# EAGLE design LCD (EAGLE 5.06)
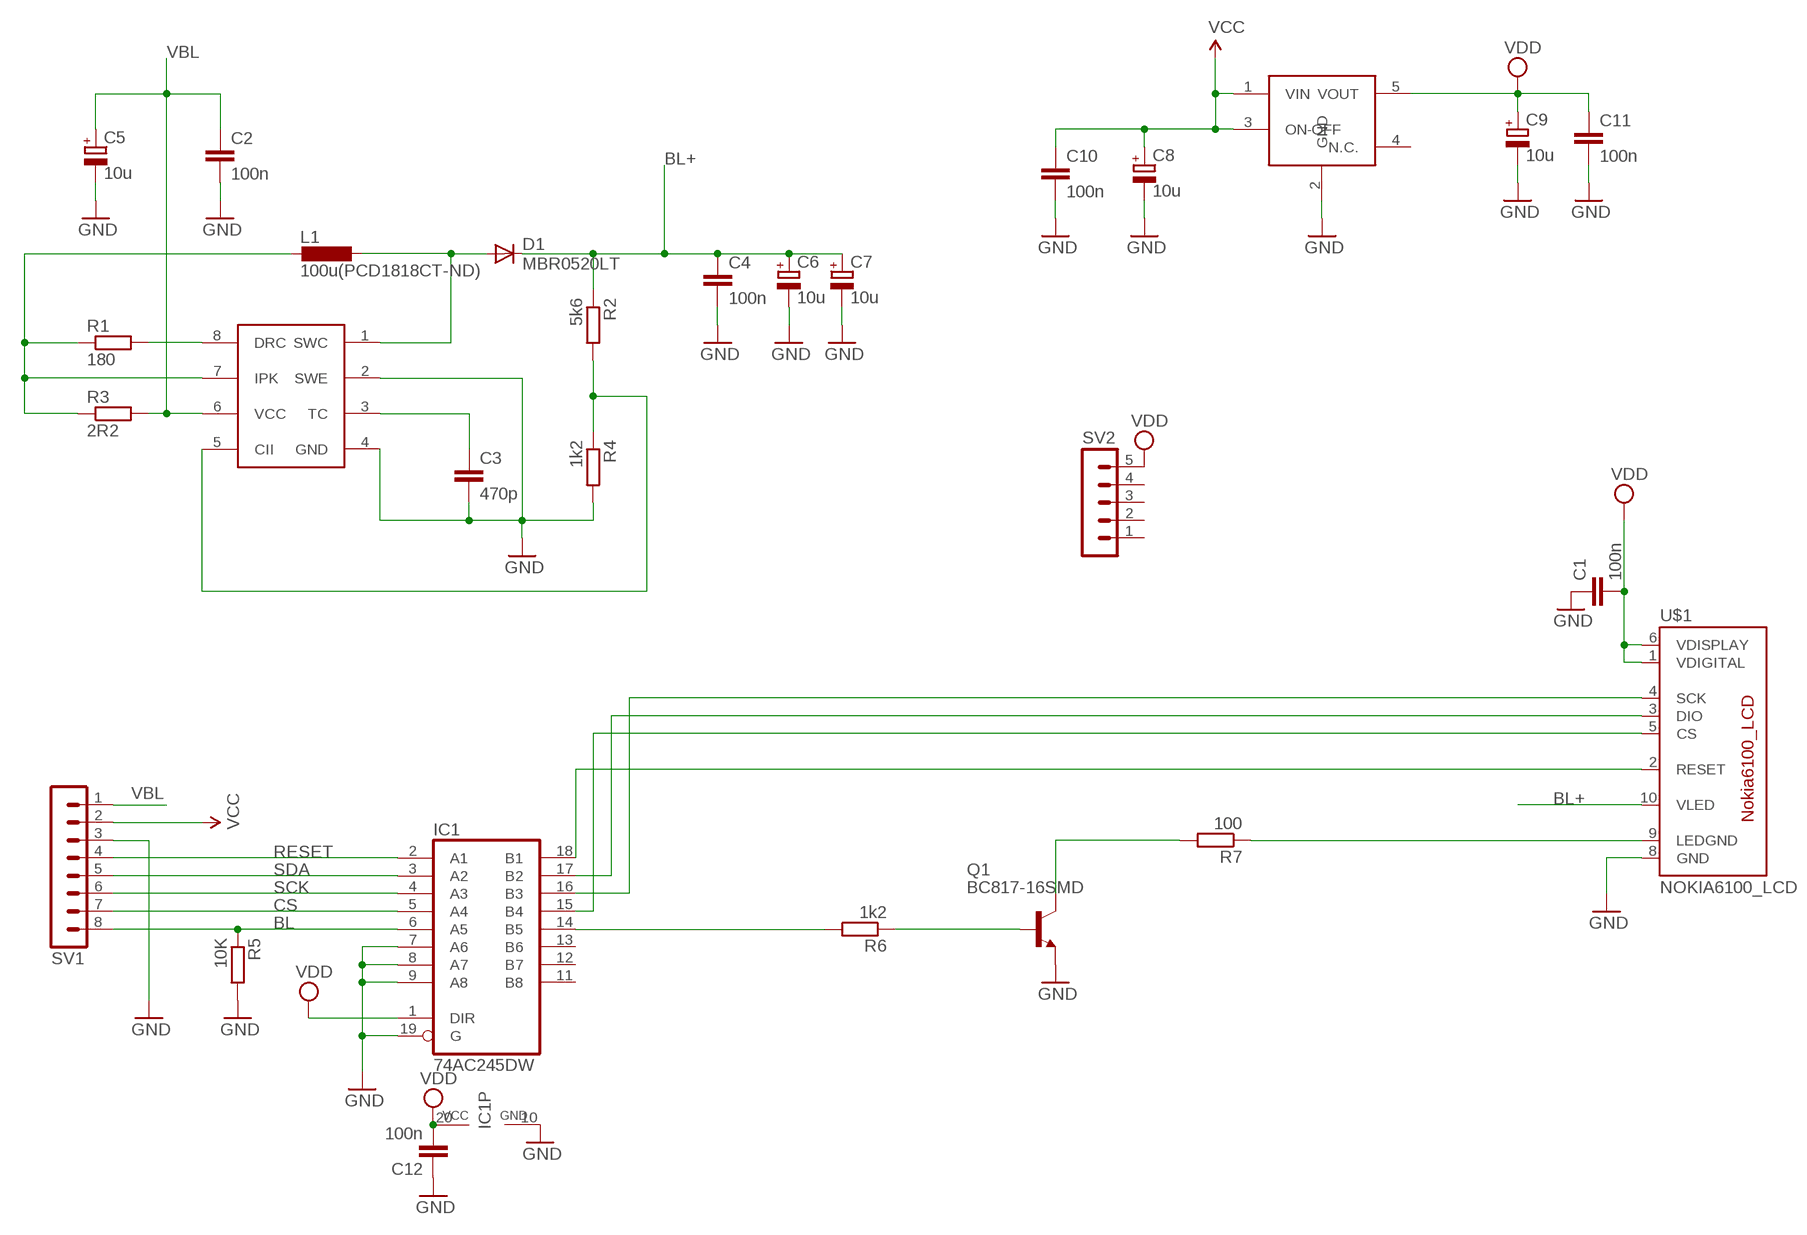
[diagram p0: schematic, sheet 1]

## Parts
C1  100n  C-EUC0805  [C0805]
C2  100n  C-EUC0805  [C0805]
C3  470p  C-EUC0805  [C0805]
C4  100n  C-EUC0805  [C0805]
C5  10u  CPOL-EUA/3216-18W  [A/3216-18W]
C6  10u  CPOL-EUA/3216-18W  [A/3216-18W]
C7  10u  CPOL-EUA/3216-18W  [A/3216-18W]
C8  10u  CPOL-EUA/3216-18W  [A/3216-18W]
C9  10u  CPOL-EUA/3216-18W  [A/3216-18W]
C10  100n  C-EUC0805  [C0805]
C11  100n  C-EUC0805  [C0805]
C12  100n  C-EUC0805  [C0805]
D1  MBR0520LT  [SOD123]
IC1  74AC245DW  [SO20W]
L1  100u(PCD1818CT-ND)  L-EUL3225M  [L3225M]
Q1  BC817-16SMD  [SOT23-BEC]
R1  180  R-EU_R0805  [R0805]
R2  5k6  R-EU_R0805  [R0805]
R3  2R2  R-EU_R0805  [R0805]
R4  1k2  R-EU_R0805  [R0805]
R5  10K  R-EU_R0805  [R0805]
R6  1k2  R-EU_R0805  [R0805]
R7  100  R-EU_R0805  [R0805]
SV1  MA08-1  [MA08-1]
SV2  MA05-1  [MA05-1]
U1  MC34063  [SO08]
U2  LP2981  [SOT23-5]
U$1  NOKIA6100_LCD  [NOKIA6100_LCD]

## Nets
BL: IC1.6(A5) R5.1 SV1.8
BL+: C4.1 C6.+ C7.+ D1.C R2.1 U$1.10(VLED)
CS: IC1.5(A4) SV1.7
GND: C1.1 C2.2 C3.2 C4.2 C5.- C6.- C7.- C8.- C9.- C10.2 C11.2 C12.1 IC1.7(A6) IC1.8(A7) IC1.9(A8) IC1.10(GND) IC1.19(G) Q1.E R4.2 R5.2 SV1.3 U1.2(SWE) U1.4(GND) U2.2(GND) U$1.8(GND)
N$1: C3.1 U1.3(TC)
N$2: Q1.B R6.1
N$3: R7.1 U$1.9(LEDGND)
N$4: IC1.18(B1) U$1.2(RESET)
N$5: IC1.15(B4) U$1.5(CS)
N$6: IC1.17(B2) U$1.3(DIO)
N$7: IC1.16(B3) U$1.4(SCK)
N$8: IC1.14(B5) R6.2
N$9: R1.2 U1.8(DRC)
N$10: D1.A L1.1 U1.1(SWC)
N$11: L1.2 R1.1 R3.1 U1.7(IPK)
N$12: R2.2 R4.1 U1.5(CII)
N$13: Q1.C R7.2
RESET: IC1.2(A1) SV1.4
SCK: IC1.4(A3) SV1.6
SDA: IC1.3(A2) SV1.5
VBL: C2.1 C5.+ R3.2 SV1.1 U1.6(VCC)
VCC: C8.+ C10.1 SV1.2 U2.1(VIN) U2.3(ON-OFF)
VDD: C1.2 C9.+ C11.1 C12.2 IC1.1(DIR) IC1.20(VCC) SV2.5 U2.5(VOUT) U$1.1(VDIGITAL) U$1.6(VDISPLAY)
Unconnected: IC1.11(B8) IC1.12(B7) IC1.13(B6) SV2.1 SV2.2 SV2.3 SV2.4 U2.4(N.C.)

## Library data of the parts
C1-C4 C10-C12 = rcl:C-EU: CAPACITOR, European symbol
C5-C9 = rcl:CPOL-EU: POLARIZED CAPACITOR, European symbol
D1 = diode:MBR0520LT: SCHOTTKY BARRIER RECTIFIER Source: http://onsemi.com .. MBR0520LT1-D.pdf
IC1 = 74xx-eu:74*245: Octal BUS TRANSCEIVER, 3-state
L1 = rcl:L-EU: INDUCTOR, European symbol
Q1 = transistor-npn:BC817*: NPN Transistor
R1-R7 = rcl:R-EU_: RESISTOR, European symbol
SV1 = con-lstb:MA08-1: PIN HEADER
SV2 = con-lstb:MA05-1: PIN HEADER
U1 = MC34063:MC34063
U2 = LP2981:LP2981
U$1 = SparkFun:NOKIA6100_LCD: Nokia 6100 Color LCD Schematic element and footprint production proven but could use some touching up. Spark Fun Electronics SKU : LCD-00569. Mating SMD connector : LCD-00570

## Net classes
0 default: width 0.203 mm, drill 0.305 mm, clearance 0.152 mm
1 power: width 0.254 mm, drill 0.508 mm, clearance 0.152 mm
2 gnd: width 0.254 mm, drill 0.508 mm, clearance 0.152 mm

## Board
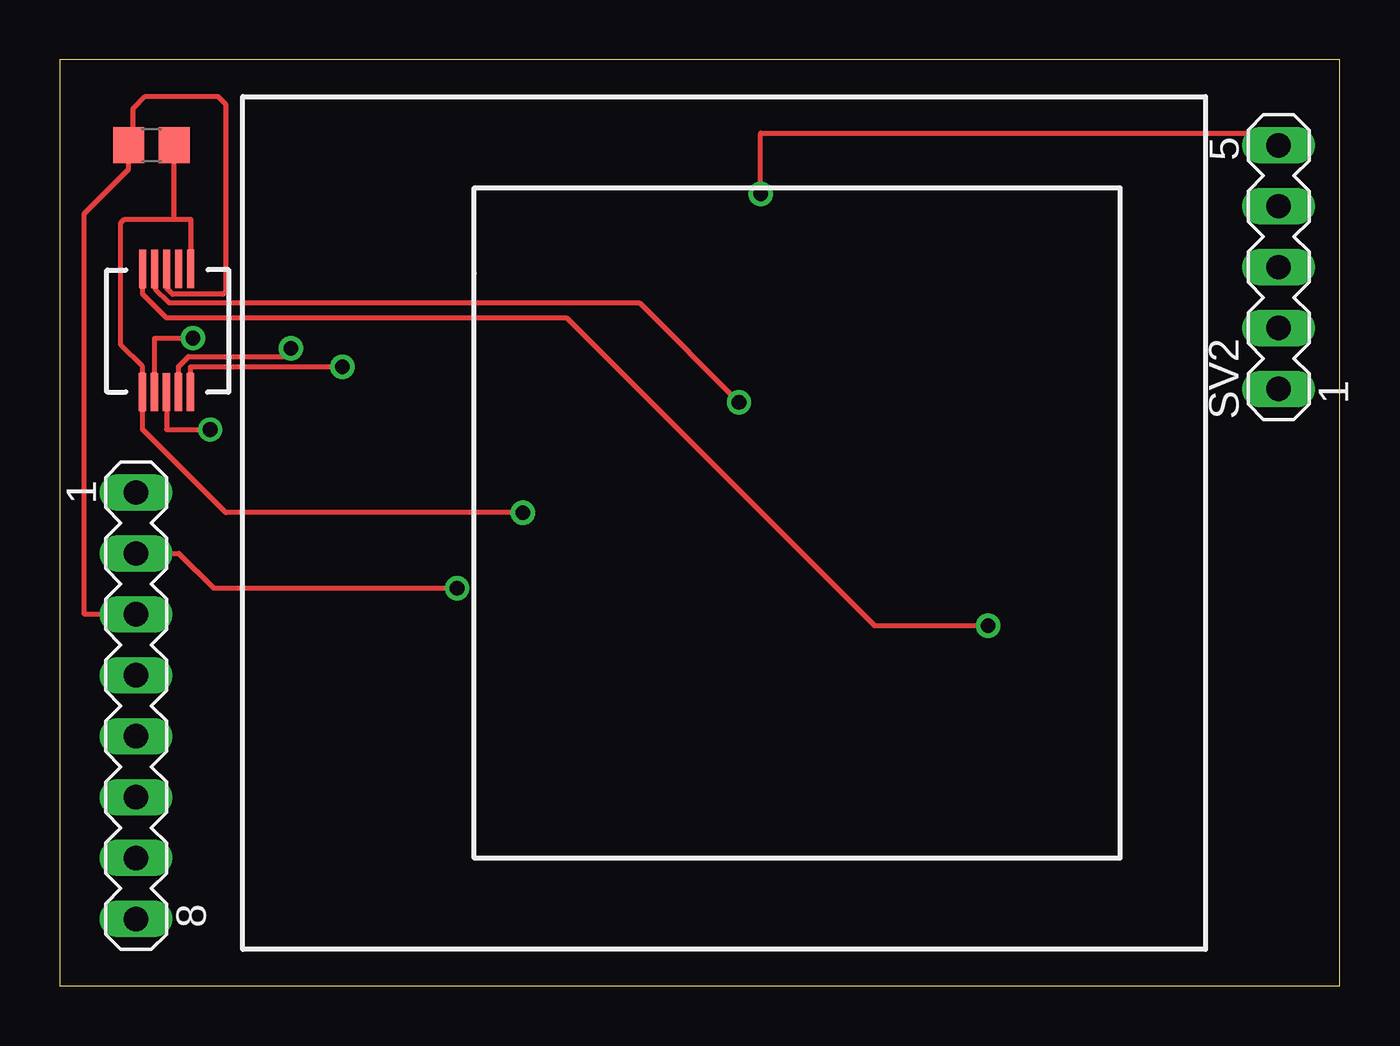
[diagram p1: board, top side]
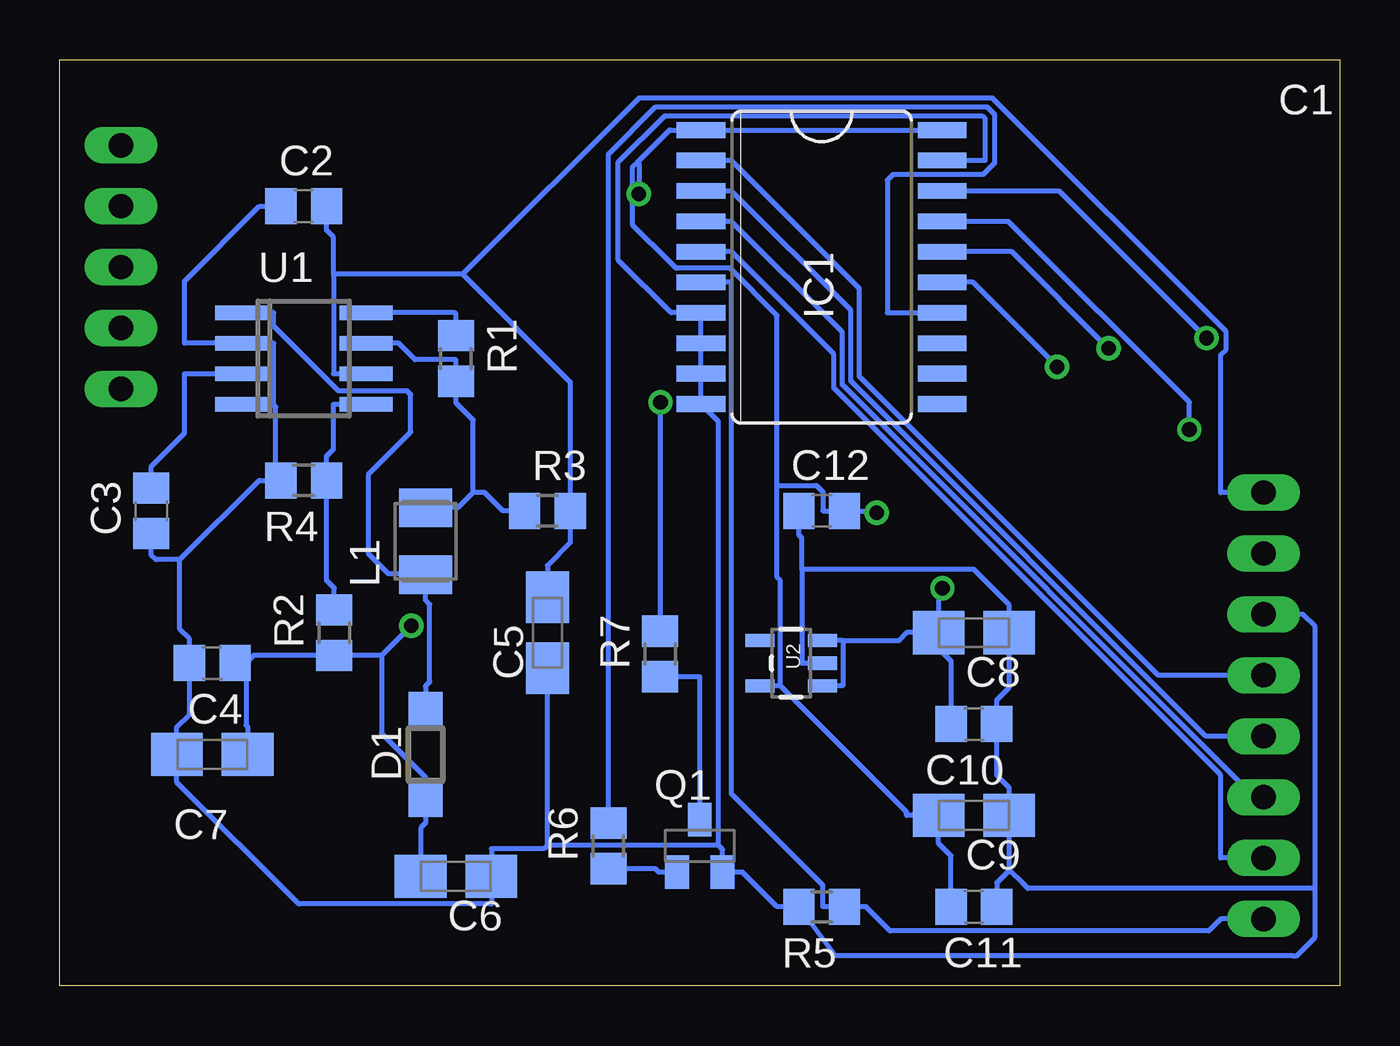
[diagram p2: board, bottom side, seen from below]

Size 53.34 x 38.61 mm. Coordinates in mm from the lower left corner, seen from the top.
Outline: 0,0 53.34,0 53.34,38.61 0,38.61 0,0
Copper layers (1*16): Top 0.035mm / dielectric 1.5mm / Bottom 0.035mm
Design rules "default *": minimum track width 6mil, minimum drill 24mil, track to track 6mil, track to pad 6mil, pad to pad 6mil, via to via 6mil, smd to smd 6mil, copper to edge 6mil, drill to drill 6mil, minimum pad ring 10mil, minimum via ring 8mil, stop-mask expansion 4mil, vias tented up to drill 0mil, thermal gap 10mil

### Footprints (pad centres in the part's own frame; a part is rotated, then mirrored left to right if it is on the bottom)
C0805 = smd 1.3 x 1.5: 1 -0.95,0; 2 0.95,0
A/3216-18W = smd 2.15 x 1.8: + 1.475,0; - -1.475,0
SOD123 = smd 1.4 x 1.4: A 1.9,0; C -1.9,0
SO20W = smd 0.66 x 2.032: 1 -5.715,-5.029; 2 -4.445,-5.029; 3 -3.175,-5.029; 4 -1.905,-5.029; 5 -0.635,-5.029; 6 0.635,-5.029; 7 1.905,-5.029; 8 3.175,-5.029; 9 4.445,-5.029; 10 5.715,-5.029; 11 5.715,5.029; 12 4.445,5.029; 13 3.175,5.029; 14 1.905,5.029; 15 0.635,5.029; 16 -0.635,5.029; 17 -1.905,5.029; 18 -3.175,5.029; 19 -4.445,5.029; 20 -5.715,5.029
L3225M = smd 1.6 x 2.2: 1 -1.4,0; 2 1.4,0
SOT23-BEC = smd 1 x 1.4: B -0.95,-1.1; C 0,1.1; E 0.95,-1.1
R0805 = smd 1.3 x 1.5: 1 -0.95,0; 2 0.95,0
MA08-1 = drill 1.016 long: 1 -8.89,0; 2 -6.35,0; 3 -3.81,0; 4 -1.27,0; 5 1.27,0; 6 3.81,0; 7 6.35,0; 8 8.89,0
MA05-1 = drill 1.016 long: 1 -5.08,0; 2 -2.54,0; 3 0,0; 4 2.54,0; 5 5.08,0
SO08 = smd 0.6 x 2.2: 1 -1.905,-2.6; 2 -0.635,-2.6; 3 0.635,-2.6; 4 1.905,-2.6; 5 1.905,2.6; 6 0.635,2.6; 7 -0.635,2.6; 8 -1.905,2.6
SOT23-5 = smd 0.55 x 1.2: 1 -0.95,-1.3; 2 0,-1.3; 3 0.95,-1.3; 4 0.95,1.3; 5 -0.95,1.3
NOKIA6100_LCD = smd 1.6 x 0.3: 1 24.255,44.311; 2 24.255,43.811; 3 24.255,43.311; 4 24.255,42.811; 5 24.255,42.311; 6 29.389,42.303; 7 29.389,42.803; 8 29.389,43.303; 9 29.389,43.803; 10 29.389,44.303

### Placement (x,y rotation side)
C1  3.81,35.05 0 top
C2  43.18,32.51 180 bottom
C3  49.53,19.81 270 bottom
C4  46.99,13.46 180 bottom
C5  33.02,14.73 90 bottom
C6  36.83,4.57 180 bottom
C7  46.99,9.65 0 bottom
C8  15.24,14.73 180 bottom
C9  15.24,7.11 180 bottom
C10  15.24,10.92 0 bottom
C11  15.24,3.3 0 bottom
C12  21.59,19.81 0 bottom
D1  38.1,9.65 90 bottom
IC1  21.59,29.97 270 bottom
L1  38.1,18.54 90 bottom
Q1  26.67,5.84 0 bottom
R1  36.83,26.16 90 bottom
R2  41.91,14.73 90 bottom
R3  33.02,19.81 0 bottom
R4  43.18,21.08 180 bottom
R5  21.59,3.3 180 bottom
R6  30.48,5.84 90 bottom
R7  28.32,13.84 270 bottom
SV1  3.17,11.68 270 top
SV2  50.8,29.97 90 top
U1  43.18,26.16 270 bottom
U2  22.86,13.46 90 bottom
U$1  47.75,0.51 90 top

### Tracks (layer width: path | path; a pad name or v marks a point on that pad's centre or on a via)
BL
  Bottom 0.203: SV1.8 4.95,2.79 5.45,2.3 18.73,2.3 19.74,3.3 R5.1 21.54,3.3 21.54,4.21 25.35,8.01 25.35,29.34 IC1.6
BL+  (via drill 0.61 pad 1.02)
  Top 0.203: U$1.10 3.45,28.84 4.43,27.86 21.11,27.86 33.95,15.03 v38.69,15.03
  Bottom 0.203: v38.69,15.03 39.94,13.78 | 39.94,13.78 R2.1 45.27,13.78 45.59,13.46 | 39.94,13.78 39.94,10.54 38.1,8.71 D1.C 38.1,6.8 38.3,6.59 C6.+ | C7.+ 45.52,10.81 45.59,10.88 45.59,13.46 | 45.59,13.46 C4.1
CS
  Bottom 0.203: IC1.5 25.35,30.61 21.08,26.34 21.08,24.92 4.95,8.79 4.95,5.33 SV1.7
GND
  Top 0.203: U$1.8 4.45,29.09 4.69,28.84 6.8,28.84 6.9,28.95 6.9,36.77 6.58,37.09 3.56,37.09 3.05,36.58 3.05,35.24 C1.1 2.86,34.05 1.02,32.2 1.02,15.49 SV1.3
  Bottom 0.203: 22.41,17.37 22.41,18.68 22.54,18.81 C12.1 | 22.41,17.37 22.41,13.46 U2.2 | 22.41,17.37 15.25,17.37 13.77,15.89 C8.- 13.77,12.45 14.29,11.93 C10.2 14.29,8.79 13.77,8.27 C9.- 13.77,4.83 | 13.77,4.83 13.18,4.25 13,4.06 1.02,4.06 | C11.2 14.29,4.31 13.77,4.83 | 25.9,5.87 25.9,23.53 IC1.10 IC1.9 IC1.8 IC1.7 27.86,28.07 30.07,30.27 30.07,34.34 28.12,36.28 14.9,36.28 14.78,36.17 14.78,34.42 IC1.19 | 33.02,5.87 33.17,5.73 35.35,5.73 C6.- 35.35,3.42 43.38,3.42 48.47,8.5 C7.- 48.47,10.81 47.94,11.33 C4.2 47.94,14.47 48.34,14.87 48.34,17.77 | 25.9,5.87 33.02,5.87 | 25.9,5.87 25.72,5.7 Q1.E 24.88,4.74 23.44,3.3 R5.2 21.01,1.27 1.96,1.27 1.78,1.27 1.02,2.03 1.02,4.06 | 33.02,5.87 C5.- | 44.34,21.08 45.03,21.08 48.34,17.77 | 44.34,21.08 R4.2 | 44.45,24.26 44.34,24.14 44.34,21.08 | 44.45,24.26 44.43,24.26 44.43,26.8 U1.2 48.15,26.8 48.15,29.4 45.03,32.51 C2.2 | 44.45,24.26 U1.4 | 48.34,17.77 49.34,17.77 49.53,17.96 C3.2 | 1.02,4.06 1.02,14.99 1.52,15.49 SV1.3
N$1
  Bottom 0.203: C3.1 49.53,21.67 48.15,23.05 48.15,25.53 U1.3
N$2
  Bottom 0.203: Q1.B 28.37,4.74 28.52,4.89 R6.1
N$3  (via drill 0.61 pad 1.02)
  Top 0.203: U$1.9 3.95,29.09 4.55,28.49 24.15,28.49 v28.31,24.33
  Bottom 0.203: v28.31,24.33 28.32,24.33 R7.1
N$4  (via drill 0.61 pad 1.02)
  Top 0.203: v5.55,27.01 3.94,27.01 3.94,25.82 U$1.2
  Bottom 0.203: IC1.18 11.68,33.15 v5.55,27.01
N$5  (via drill 0.61 pad 1.02)
  Top 0.203: v11.77,25.82 5.44,25.82 U$1.5
  Bottom 0.203: v11.77,25.82 15.29,29.34 IC1.15
N$6  (via drill 0.61 pad 1.02)
  Top 0.203: v6.26,23.2 4.44,23.2 U$1.3
  Bottom 0.203: 15.29,31.88 | 15.29,31.88 13.8,31.88 6.26,24.34 v6.26,23.2 | 15.29,31.88 IC1.17
N$7  (via drill 0.61 pad 1.02)
  Top 0.203: U$1.4 4.94,25.83 5.36,26.25 9.3,26.25 v9.63,26.58
  Bottom 0.203: IC1.16 13.65,30.61 v9.63,26.58
N$8
  Bottom 0.203: IC1.14 18.85,28.07 18.85,33.6 18.62,33.83 14.86,33.83 14.39,34.3 14.39,36.34 14.69,36.65 28.51,36.65 30.48,34.68 R6.2
N$9
  Bottom 0.203: R1.2 36.83,28.02 36.88,28.07 U1.8
N$10
  Bottom 0.203: U1.1 44.43,28.07 44.43,27.51 41.72,24.81 38.86,24.81 38.72,24.66 38.72,23.1 40.47,21.35 40.47,18.01 39.64,17.18 39.12,17.18 L1.1 38.1,16.09 37.92,15.91 37.92,12.68 38.1,12.51 D1.A
N$11
  Bottom 0.203: 36.12,20.57 36.75,19.94 L1.2 | 36.12,20.57 35.63,20.57 34.87,19.81 R3.1 | 36.12,20.57 36.12,23.6 36.83,24.31 R1.1 36.83,26.12 38.55,26.12 39.23,26.8 U1.7
N$12
  Bottom 0.203: U1.5 41.93,24.26 41.93,22.38 42.23,22.09 R4.1 42.23,16.91 41.91,16.59 R2.2
N$13
  Bottom 0.203: Q1.C 26.67,9.07 26.67,12.89 R7.2
RESET
  Bottom 0.203: IC1.2 25.35,34.42 20.02,29.08 20.02,25.42 7.55,12.95 4.95,12.95 SV1.4
SCK
  Bottom 0.203: SV1.6 3.53,7.87 20.73,25.07 20.73,27.25 25.35,31.88 IC1.4
SDA
  Bottom 0.203: IC1.3 25.35,33.15 20.37,28.17 20.37,25.22 5.57,10.41 4.95,10.41 SV1.5
VBL
  Bottom 0.203: 41.93,29.67 41.93,31.21 42.23,31.51 C2.1 | 41.93,29.67 41.93,25.53 U1.6 | 36.55,29.67 41.93,29.67 | 36.55,29.67 32.07,25.19 R3.2 32.07,18.49 33.02,17.54 C5.+ | 36.55,29.67 29.21,37.02 14.47,37.02 4.73,27.28 4.73,26.54 4.95,26.32 4.95,20.57 SV1.1
VCC  (via drill 0.61 pad 1.02)
  Top 0.203: v16.55,16.59 6.4,16.59 4.95,18.03 SV1.2
  Bottom 0.203: 17.38,14.73 16.19,13.54 C10.1 | 17.38,14.73 18.04,14.73 18.38,14.39 20.71,14.39 | 17.38,14.73 C8.+ 16.71,16.43 v16.55,16.59 | 20.71,14.39 20.72,14.41 20.8,14.41 U2.3 | 20.71,14.39 20.71,12.51 U2.1
VDD  (via drill 0.61, 0.61 pad 1.02)
  Top 0.203: 4.76,31.97 5.45,31.97 U$1.6 | 4.76,31.97 2.68,31.97 2.54,31.82 2.54,26.72 3.44,25.82 U$1.1 3.44,24.24 3.44,23.2 6.91,19.73 v19.29,19.73 | 4.76,31.97 4.76,34.05 C1.2 | v29.21,33.02 29.21,35.56 50.8,35.56 SV2.5
  Bottom 0.203: 23.44,20.87 | 23.44,20.87 23.44,17.04 23.31,16.9 23.31,12.51 | 23.44,20.87 23.44,27.96 25.41,29.92 27.66,29.92 27.89,30.15 29.46,31.73 29.46,34.16 29.27,34.35 | 23.44,20.87 21.81,20.87 21.54,20.6 21.54,19.81 C12.2 19.74,19.81 19.66,19.73 v19.29,19.73 | 23.31,12.51 U2.5 | 23.31,12.51 18.04,7.25 18.04,7.11 C9.+ 16.71,5.96 16.19,5.43 C11.1 | IC1.20 17.83,35.69 25.35,35.69 IC1.1 27.89,35.69 27.94,35.69 29.27,34.35 | v29.21,33.02 29.21,34.29 29.27,34.35